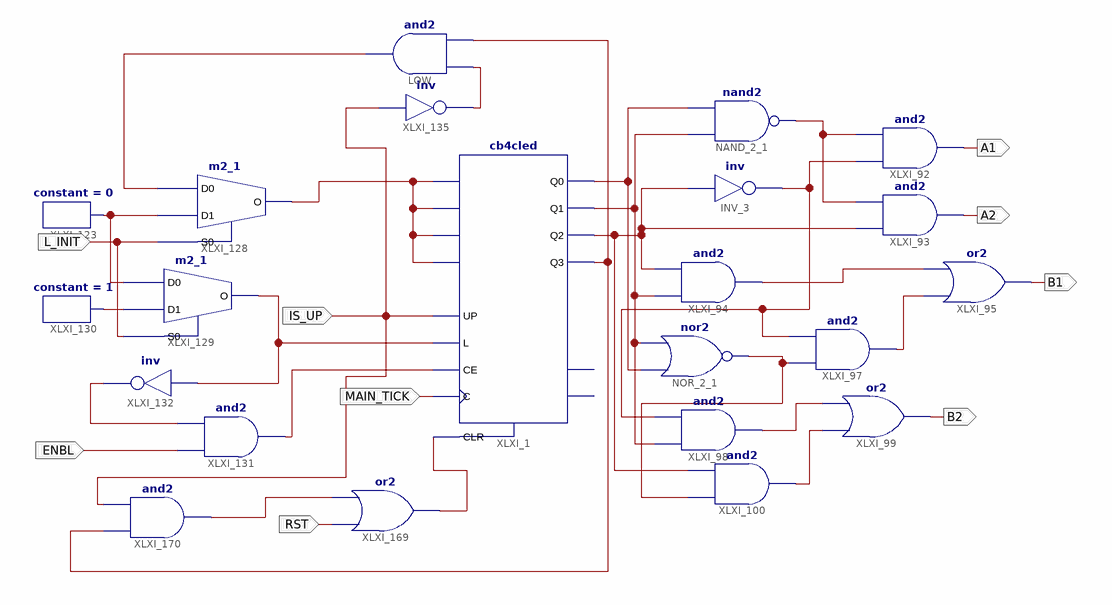
[diagram p0: schematic sheet 1]
// Xilinx ISE schematic sdc.sch (spartan6) as structural Verilog: 22 symbols, 9 ports
module sdc (
  input  MAIN_TICK,
  input  ENBL,
  input  L_INIT,
  input  IS_UP,
  input  RST,
  output A1,
  output A2,
  output B1,
  output B2
);

  wire load, XLXN_187, XLXN_195, XLXN_202, XLXN_208, XLXN_209, XLXN_214, XLXN_215, XLXN_216, XLXN_312,
       XLXN_315, XLXN_316, XLXN_320, XLXN_322, XLXN_327, XLXN_336, XLXN_378, XLXN_380, XLXN_389, XLXN_391,
       XLXN_394;

  cb4cled XLXI_1 (
    .C(MAIN_TICK), .CE(XLXN_322), .CLR(XLXN_389), .D0(XLXN_312), .D1(XLXN_312), .D2(XLXN_312), .D3(XLXN_312),
    .L(load), .UP(IS_UP), .Q0(XLXN_216), .Q1(XLXN_215), .Q2(XLXN_214), .Q3(XLXN_394));  // open: CEO, TC
  nand NAND_2_1 (XLXN_187, XLXN_215, XLXN_216);
  not INV_3 (XLXN_202, XLXN_214);
  and XLXI_92 (A1, XLXN_202, XLXN_187);
  and XLXI_93 (A2, XLXN_214, XLXN_187);
  and XLXI_94 (XLXN_378, XLXN_215, XLXN_214);
  and XLXI_97 (XLXN_380, XLXN_195, XLXN_202);
  or XLXI_95 (B1, XLXN_380, XLXN_378);
  nor NOR_2_1 (XLXN_195, XLXN_216, XLXN_215);
  or XLXI_99 (B2, XLXN_209, XLXN_208);
  and XLXI_100 (XLXN_209, XLXN_195, XLXN_214);
  and XLXI_98 (XLXN_208, XLXN_215, XLXN_202);
  and XLXI_131 (XLXN_322, ENBL, XLXN_320);
  and LOW (XLXN_336, XLXN_394, XLXN_327);
  not XLXI_135 (XLXN_327, IS_UP);
  m2_1 XLXI_128 (.D0(XLXN_336), .D1(XLXN_315), .S0(L_INIT), .O(XLXN_312));
  constant #(.CValue("0")) XLXI_123 (.O(XLXN_315));
  m2_1 XLXI_129 (.D0(XLXN_315), .D1(XLXN_316), .S0(L_INIT), .O(load));
  not XLXI_132 (XLXN_320, load);
  constant #(.CValue("1")) XLXI_130 (.O(XLXN_316));
  or XLXI_169 (XLXN_389, RST, XLXN_391);
  and XLXI_170 (XLXN_391, XLXN_394, IS_UP);
endmodule
